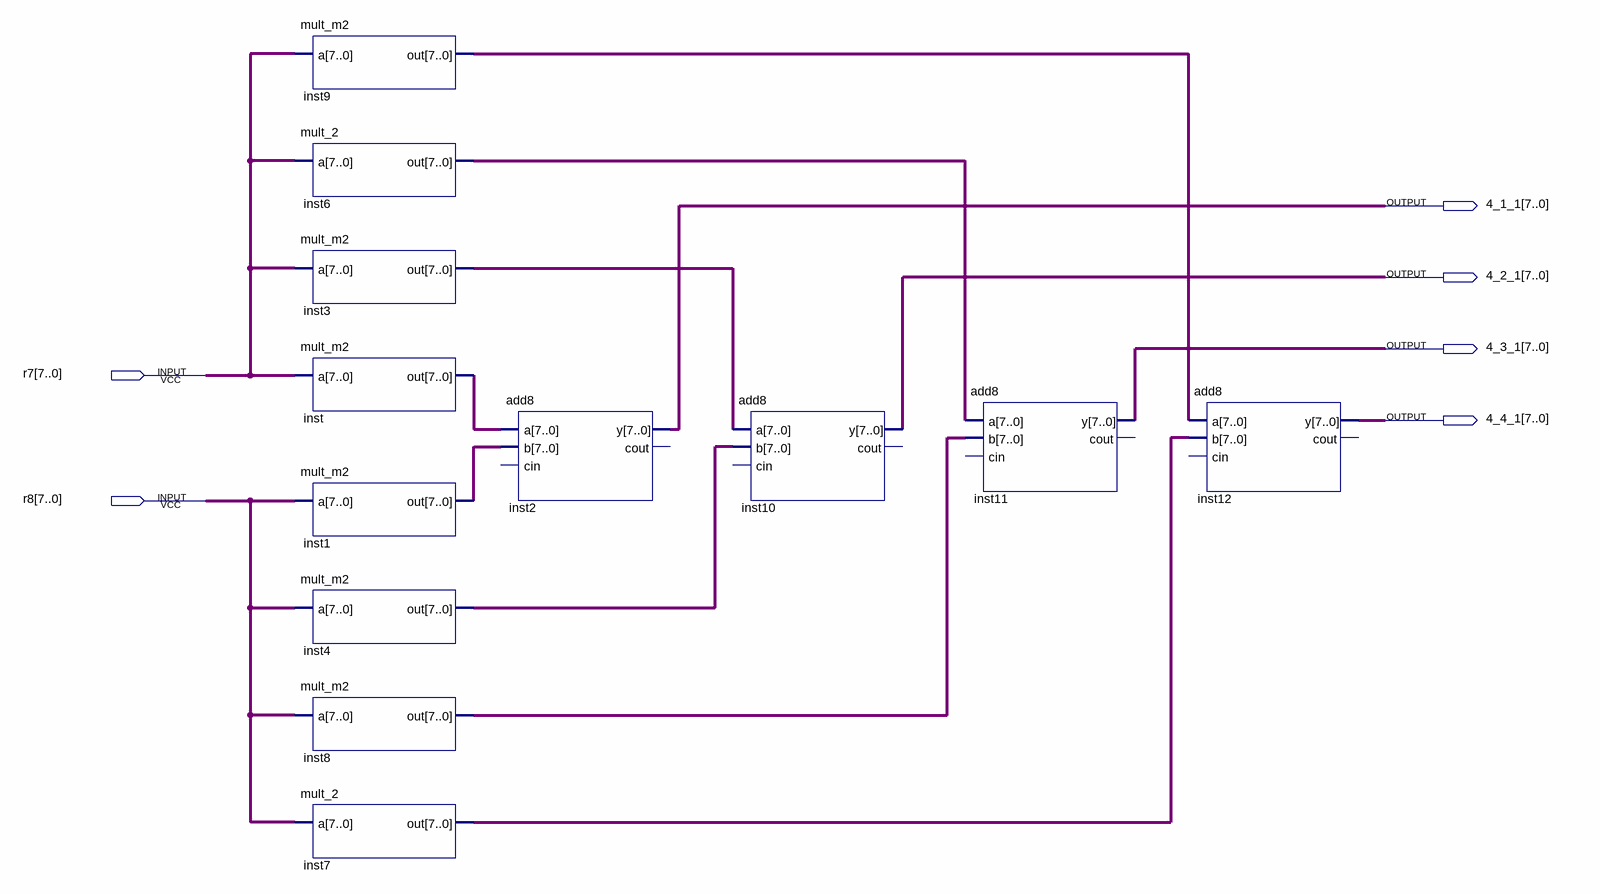
[diagram p0: schematic sheet]
// Quartus schematic stage_4.bdf as structural Verilog: 12 symbols, 6 pins
module stage_4 (
  input  [7:0] r7,
  input  [7:0] r8,
  output [7:0] \4_1_1 ,
  output [7:0] \4_2_1 ,
  output [7:0] \4_3_1 ,
  output [7:0] \4_4_1 
);

  wire [7:0] inst1_out, inst3_out, inst4_out, inst6_out, inst7_out, inst8_out, inst9_out, inst_out;

  mult_m2 inst9 (.a(r7), .out(inst9_out));
  mult_2 inst6 (.a(r7), .out(inst6_out));
  mult_m2 inst3 (.a(r7), .out(inst3_out));
  mult_m2 inst (.a(r7), .out(inst_out));
  mult_m2 inst1 (.a(r8), .out(inst1_out));
  mult_m2 inst4 (.a(r8), .out(inst4_out));
  mult_m2 inst8 (.a(r8), .out(inst8_out));
  mult_2 inst7 (.a(r8), .out(inst7_out));
  add8 inst2 (.a(inst_out), .b(inst1_out), .y(\4_1_1 ));  // open: cin, cout
  add8 inst10 (.a(inst3_out), .b(inst4_out), .y(\4_2_1 ));  // open: cin, cout
  add8 inst11 (.a(inst6_out), .b(inst8_out), .y(\4_3_1 ));  // open: cin, cout
  add8 inst12 (.a(inst9_out), .b(inst7_out), .y(\4_4_1 ));  // open: cin, cout
endmodule
